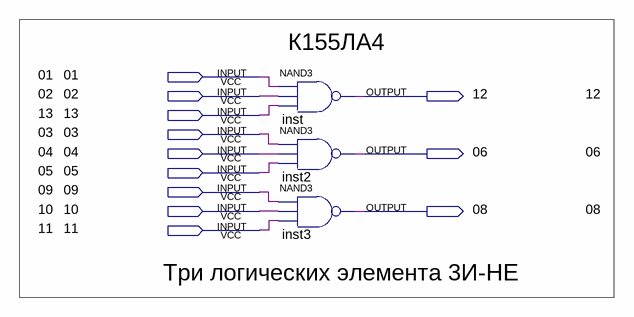
[diagram p0: schematic sheet]
// Quartus schematic K155LA4.bdf as structural Verilog: 3 symbols, 12 pins
module K155LA4 (
  input  \01 ,
  input  \02 ,
  input  \13 ,
  input  \03 ,
  input  \04 ,
  input  \05 ,
  input  \09 ,
  input  \10 ,
  input  \11 ,
  output \12 ,
  output \06 ,
  output \08 
);

  nand inst (\12 , \01 , \02 , \13 );
  nand inst2 (\06 , \03 , \04 , \05 );
  nand inst3 (\08 , \09 , \10 , \11 );

  // Notes on the sheet:
  //   К155ЛА4
  //   01
  //   02
  //   12
  //   13
  //   03
  //   04
  //   06
  //   05
  //   09
  //   10
  //   08
  //   11
  //   Три логических элемента 3И-НЕ
endmodule
